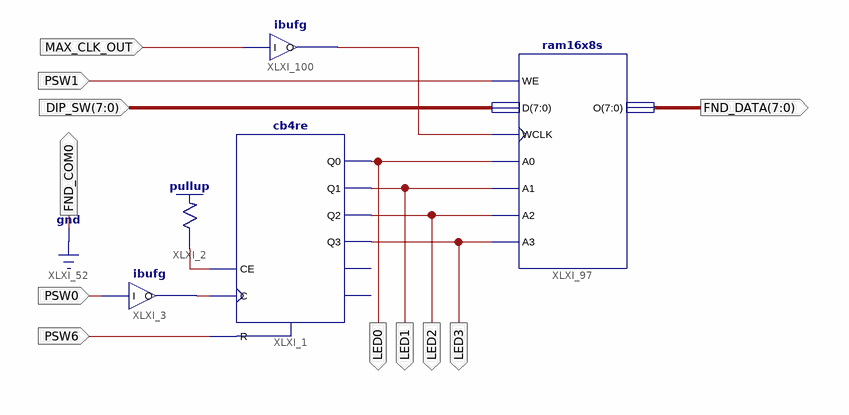
[diagram p0: schematic sheet 1]
// Xilinx ISE schematic lab9_extsram.sch (spartan3) as structural Verilog: 5 symbols, 12 ports
module lab9_extsram (
  input  PSW0,
  input  PSW6,
  input  MAX_CLK_OUT,
  input  PSW1,
  input  [7:0] DIP_SW,
  output [7:0] FND_DATA,
  output LED0,
  output LED1,
  output LED2,
  output XLXN_324,
  output LED3,
  output FND_COM0
);

  wire XLXN_3, XLXN_4;

  cb4re XLXI_1 (.C(XLXN_4), .CE(XLXN_3), .R(PSW6), .Q0(LED0), .Q1(LED1), .Q2(LED2), .Q3(LED3));  // open: CEO, TC
  \pullup  XLXI_2 (.O(XLXN_3));
  ibufg XLXI_3 (.I(PSW0), .O(XLXN_4));
  ram16x8s XLXI_97 (.A0(LED0), .A1(LED1), .A2(LED2), .A3(LED3), .D(DIP_SW), .WCLK(XLXN_324), .WE(PSW1), .O(FND_DATA));
  ibufg XLXI_100 (.I(MAX_CLK_OUT), .O(XLXN_324));

  assign FND_COM0 = 1'b0;
endmodule
